# Altium schematic sheet CONN.SchDoc: =ProjectName
size A4; CheckedBy: DatNB; Author: Ven; CompanyName: Nacentech; Organization: IMET
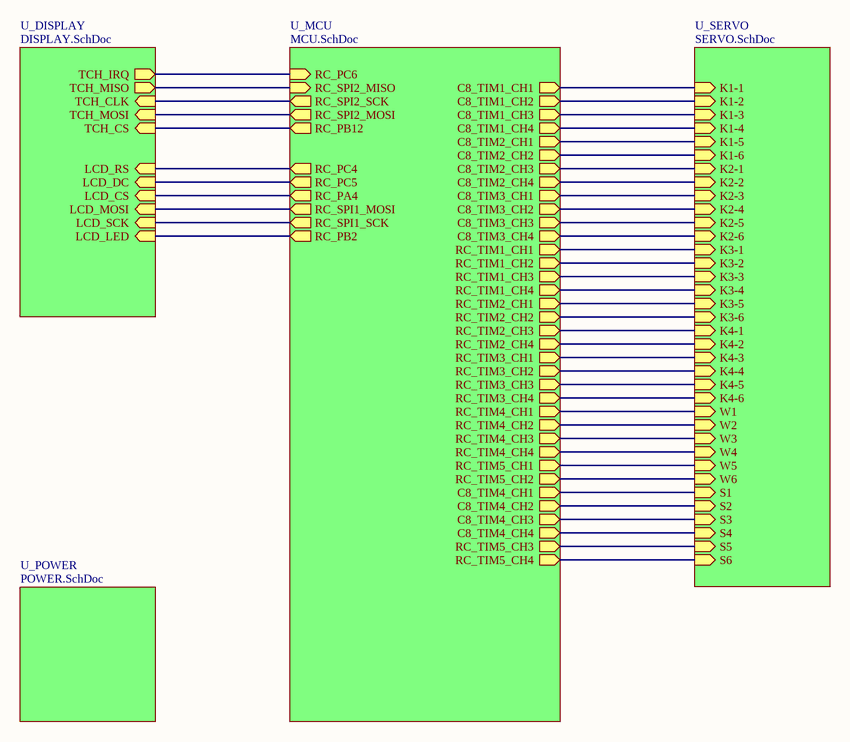
[diagram p0: CONN.SchDoc]

## Sub-sheets
U_DISPLAY = DISPLAY.SchDoc: TCH_CLK (in), TCH_MISO (out), TCH_IRQ (out), LCD_MOSI (in), LCD_RS (in), LCD_DC (in), LCD_SCK (in), LCD_LED (in), TCH_MOSI (in), TCH_CS (in), LCD_CS (in)
U_MCU = MCU.SchDoc: RC_TIM3_CH4 (out), RC_SPI2_SCK (out), RC_SPI1_MOSI (out), C8_TIM3_CH3 (out), RC_PA4 (out), RC_PB2 (out), RC_TIM2_CH4 (out), C8_TIM3_CH1 (out), RC_TIM4_CH1 (out), RC_PC5 (out), RC_TIM5_CH4 (out), C8_TIM1_CH4 (out), RC_TIM3_CH2 (out), RC_PC4 (out), RC_TIM5_CH1 (out), C8_TIM1_CH1 (out), RC_PC6 (in), C8_TIM2_CH2 (out), RC_SPI2_MOSI (out), RC_SPI1_SCK (out), RC_TIM4_CH3 (out), RC_TIM2_CH2 (out), RC_TIM4_CH2 (out), C8_TIM1_CH3 (out), RC_TIM3_CH3 (out), RC_TIM4_CH4 (out), RC_TIM3_CH1 (out), RC_TIM5_CH3 (out), RC_PB12 (out), C8_TIM1_CH2 (out), C8_TIM2_CH3 (out), C8_TIM2_CH4 (out), C8_TIM3_CH2 (out), C8_TIM2_CH1 (out), C8_TIM3_CH4 (out), C8_TIM4_CH4 (out), C8_TIM4_CH2 (out), C8_TIM4_CH1 (out), C8_TIM4_CH3 (out), RC_TIM1_CH2 (out), RC_TIM1_CH3 (out), RC_TIM1_CH4 (out), RC_TIM1_CH1 (out), RC_TIM2_CH3 (out), RC_TIM2_CH1 (out), RC_TIM5_CH2 (out), RC_SPI2_MISO (in)
U_POWER = POWER.SchDoc: no entries
U_SERVO = SERVO.SchDoc: K1-1 (in), K1-2 (in), K1-3 (in), K1-4 (in), K1-5 (in), K1-6 (in), K2-1 (in), K2-2 (in), K2-3 (in), K2-4 (in), K2-5 (in), K2-6 (in), K3-1 (in), K3-2 (in), K3-3 (in), K3-4 (in), K3-5 (in), K3-6 (in), K4-1 (in), K4-2 (in), K4-3 (in), K4-4 (in), K4-5 (in), K4-6 (in), W1 (in), W2 (in), W3 (in), W4 (in), W5 (in), W6 (in), S1 (in), S2 (in), S3 (in), S4 (in), S5 (in), S6 (in)

## Nets
(unnamed): sheet U_DISPLAY/TCH_CLK, sheet U_MCU/RC_SPI2_SCK
(unnamed): sheet U_DISPLAY/TCH_MISO, sheet U_MCU/RC_SPI2_MISO
(unnamed): sheet U_DISPLAY/TCH_IRQ, sheet U_MCU/RC_PC6
(unnamed): sheet U_DISPLAY/LCD_MOSI, sheet U_MCU/RC_SPI1_MOSI
(unnamed): sheet U_DISPLAY/LCD_RS, sheet U_MCU/RC_PC4
(unnamed): sheet U_DISPLAY/LCD_DC, sheet U_MCU/RC_PC5
(unnamed): sheet U_DISPLAY/LCD_SCK, sheet U_MCU/RC_SPI1_SCK
(unnamed): sheet U_DISPLAY/LCD_LED, sheet U_MCU/RC_PB2
(unnamed): sheet U_DISPLAY/TCH_MOSI, sheet U_MCU/RC_SPI2_MOSI
(unnamed): sheet U_DISPLAY/TCH_CS, sheet U_MCU/RC_PB12
(unnamed): sheet U_DISPLAY/LCD_CS, sheet U_MCU/RC_PA4
(unnamed): sheet U_MCU/RC_TIM3_CH4, sheet U_SERVO/K4-6
(unnamed): sheet U_MCU/C8_TIM3_CH3, sheet U_SERVO/K2-5
(unnamed): sheet U_MCU/RC_TIM2_CH4, sheet U_SERVO/K4-2
(unnamed): sheet U_MCU/C8_TIM3_CH1, sheet U_SERVO/K2-3
(unnamed): sheet U_MCU/RC_TIM4_CH1, sheet U_SERVO/W1
(unnamed): sheet U_MCU/RC_TIM5_CH4, sheet U_SERVO/S6
(unnamed): sheet U_MCU/C8_TIM1_CH4, sheet U_SERVO/K1-4
(unnamed): sheet U_MCU/RC_TIM3_CH2, sheet U_SERVO/K4-4
(unnamed): sheet U_MCU/RC_TIM5_CH1, sheet U_SERVO/W5
(unnamed): sheet U_MCU/C8_TIM1_CH1, sheet U_SERVO/K1-1
(unnamed): sheet U_MCU/C8_TIM2_CH2, sheet U_SERVO/K1-6
(unnamed): sheet U_MCU/RC_TIM4_CH3, sheet U_SERVO/W3
(unnamed): sheet U_MCU/RC_TIM2_CH2, sheet U_SERVO/K3-6
(unnamed): sheet U_MCU/RC_TIM4_CH2, sheet U_SERVO/W2
(unnamed): sheet U_MCU/C8_TIM1_CH3, sheet U_SERVO/K1-3
(unnamed): sheet U_MCU/RC_TIM3_CH3, sheet U_SERVO/K4-5
(unnamed): sheet U_MCU/RC_TIM4_CH4, sheet U_SERVO/W4
(unnamed): sheet U_MCU/RC_TIM3_CH1, sheet U_SERVO/K4-3
(unnamed): sheet U_MCU/RC_TIM5_CH3, sheet U_SERVO/S5
(unnamed): sheet U_MCU/C8_TIM1_CH2, sheet U_SERVO/K1-2
(unnamed): sheet U_MCU/C8_TIM2_CH3, sheet U_SERVO/K2-1
(unnamed): sheet U_MCU/C8_TIM2_CH4, sheet U_SERVO/K2-2
(unnamed): sheet U_MCU/C8_TIM3_CH2, sheet U_SERVO/K2-4
(unnamed): sheet U_MCU/C8_TIM2_CH1, sheet U_SERVO/K1-5
(unnamed): sheet U_MCU/C8_TIM3_CH4, sheet U_SERVO/K2-6
(unnamed): sheet U_MCU/C8_TIM4_CH4, sheet U_SERVO/S4
(unnamed): sheet U_MCU/C8_TIM4_CH2, sheet U_SERVO/S2
(unnamed): sheet U_MCU/C8_TIM4_CH1, sheet U_SERVO/S1
(unnamed): sheet U_MCU/C8_TIM4_CH3, sheet U_SERVO/S3
(unnamed): sheet U_MCU/RC_TIM1_CH2, sheet U_SERVO/K3-2
(unnamed): sheet U_MCU/RC_TIM1_CH3, sheet U_SERVO/K3-3
(unnamed): sheet U_MCU/RC_TIM1_CH4, sheet U_SERVO/K3-4
(unnamed): sheet U_MCU/RC_TIM1_CH1, sheet U_SERVO/K3-1
(unnamed): sheet U_MCU/RC_TIM2_CH3, sheet U_SERVO/K4-1
(unnamed): sheet U_MCU/RC_TIM2_CH1, sheet U_SERVO/K3-5
(unnamed): sheet U_MCU/RC_TIM5_CH2, sheet U_SERVO/W6

## Notes on the sheet
- Project:
- Page Contents:
- Size:
- Date:
- A4
- Checked by:
- Time:
- Revision:
- Sheet
- of
- File: